# EAGLE schematic iron-hotplate (EAGLE 9.6.2)
CREVISION: 1.0; DESIGNER: Joao Silva

## Sheet 1 of 3: MCU
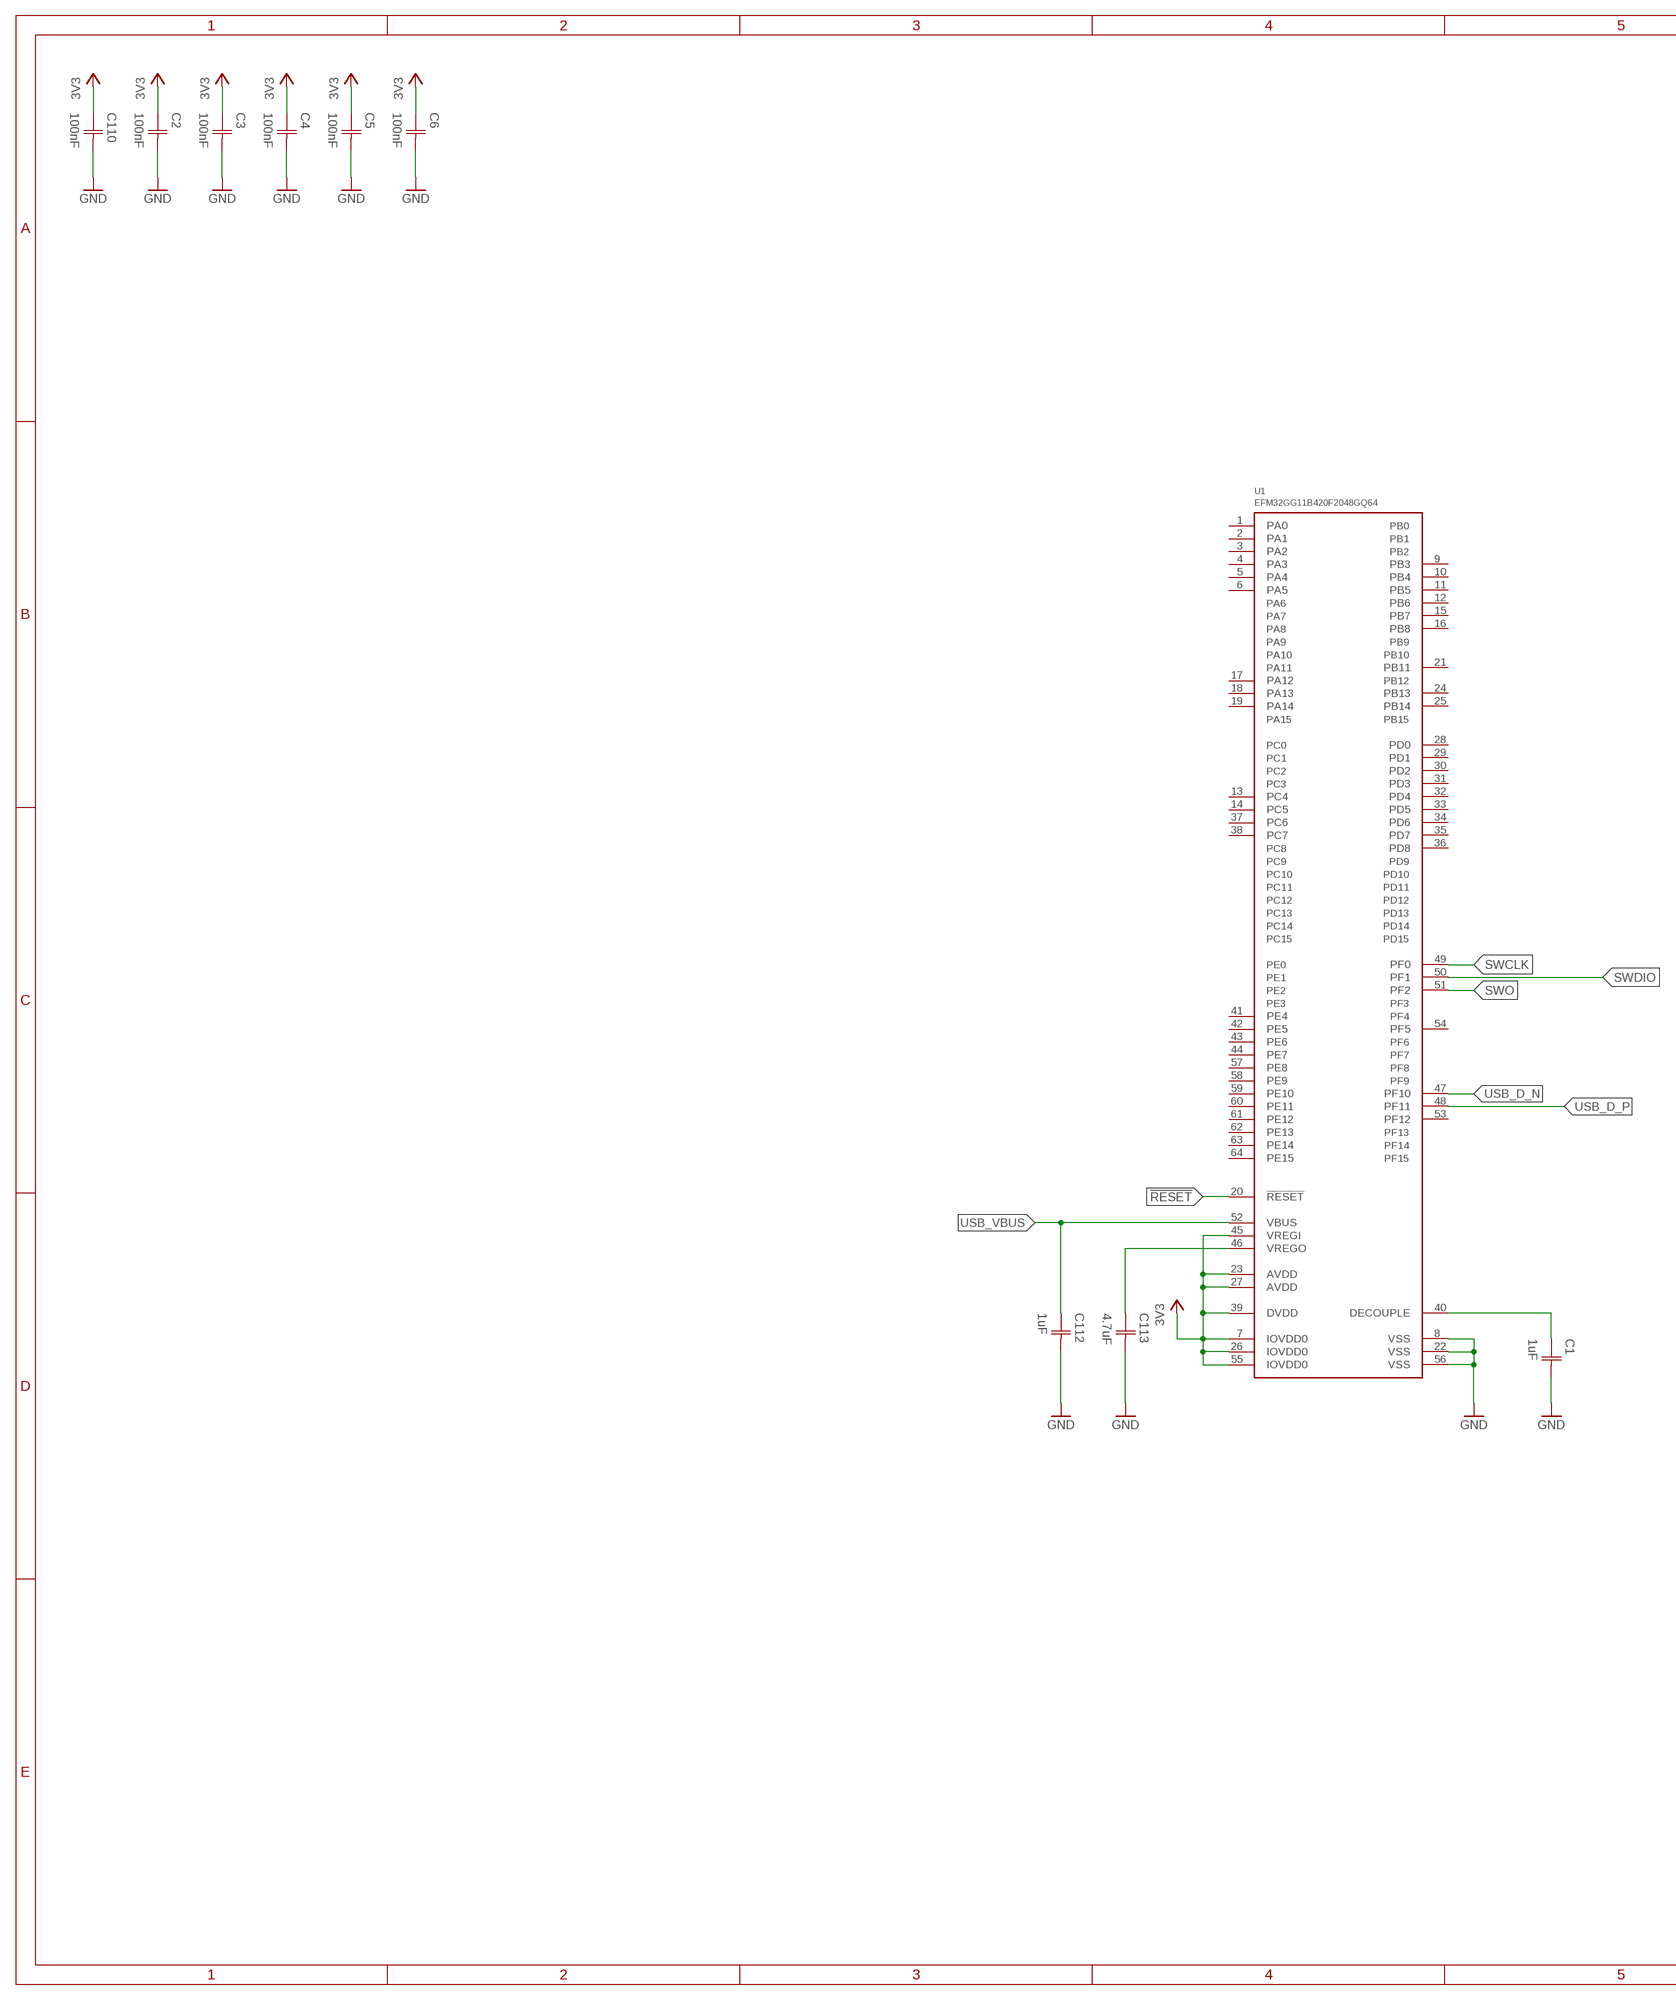
[diagram p0: schematic, sheet 1, part 1 of 2]
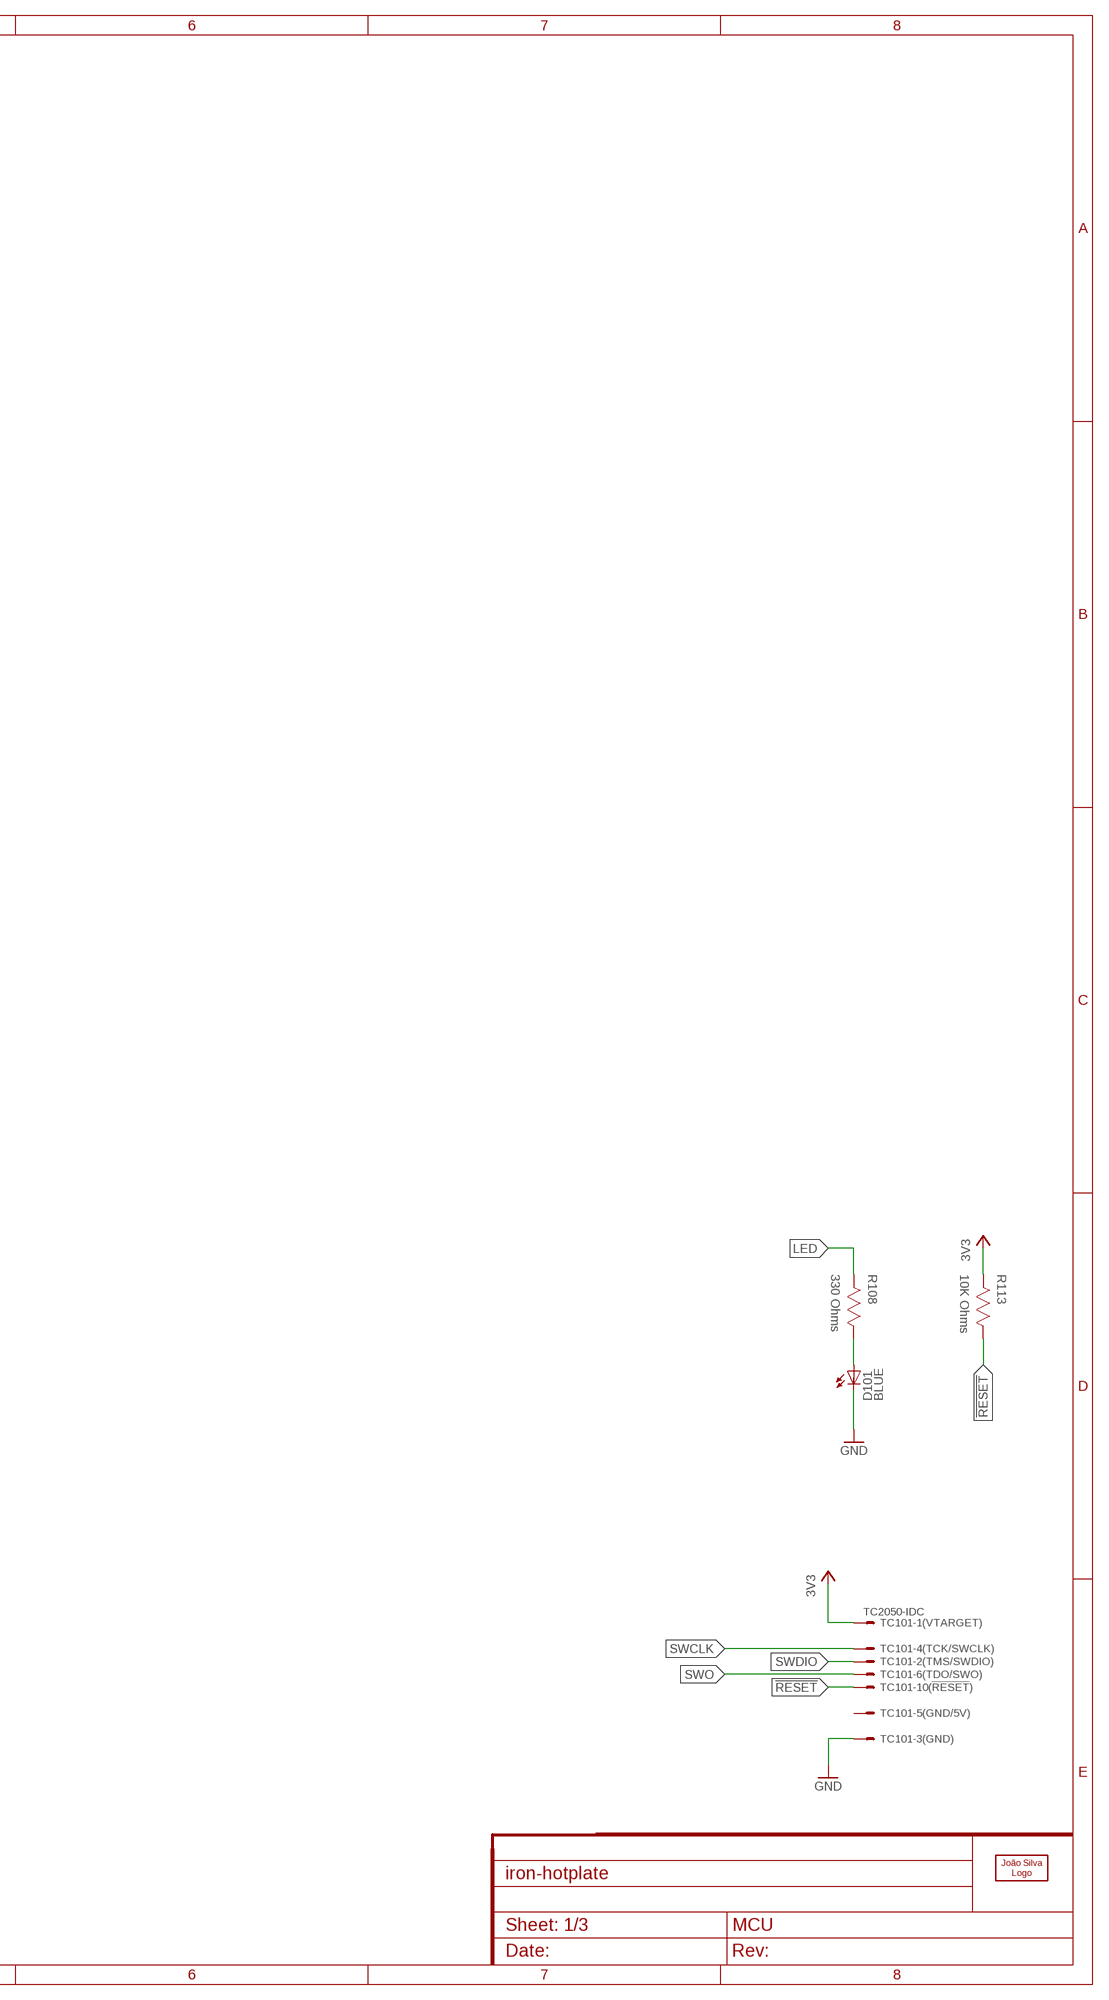
[diagram p1: schematic, sheet 1, part 2 of 2]

### Parts
C1  1uF  CAPACITOR-0402  [CAP0402]
C2  100nF  CAPACITOR-0402  [CAP0402]
C3  100nF  CAPACITOR-0402  [CAP0402]
C4  100nF  CAPACITOR-0402  [CAP0402]
C5  100nF  CAPACITOR-0402  [CAP0402]
C6  100nF  CAPACITOR-0402  [CAP0402]
C110  100nF  CAPACITOR-0402  [CAP0402]
C112  1uF  CAPACITOR-0402  [CAP0402]
C113  4.7uF  CAPACITOR-0603  [CAP0603]
D101  LED0603  [0603]
LOGO1  JS-5MM  [JS_5MM]
R108  330 Ohms  RESISTOR-0402  [RES0402]
R113  10K Ohms  RESISTOR-0402  [RES0402]
TC101  TC2050-IDC  [TC2050-IDC]
U1  EFM32GG11B420F2048GQ64  [QFP64]

### Nets
3V3: C2.1(C1) C3.1(C1) C4.1(C1) C5.1(C1) C6.1(C1) C110.1(C1) R113.2 TC101.1 U1.7(IOVDD0) U1.23(AVDD) U1.26(IOVDD0) U1.27(AVDD) U1.39(DVDD) U1.45(VREGI) U1.55(IOVDD0) ; also sheet 2,3
!RESET: R113.1 TC101.10 U1.20(!RESET)
GND: C1.2(C2) C2.2(C2) C3.2(C2) C4.2(C2) C5.2(C2) C6.2(C2) C110.2(C2) C112.2(C2) C113.2(C2) D101.C TC101.3 U1.8(VSS) U1.22(VSS) U1.56(VSS) ; also sheet 2,3
LED: R108.2
N$1: C1.1(C1) U1.40(DECOUPLE)
N$32: C113.1(C1) U1.46(VREGO)
N$144: D101.A R108.1
SWCLK: TC101.4 U1.49(PF0)
SWDIO: TC101.2 U1.50(PF1)
SWO: TC101.6 U1.51(PF2)
USB_D_N [90 Ohm Differential]: U1.47(PF10)
USB_D_P [90 Ohm Differential]: U1.48(PF11)
USB_VBUS: C112.1(C1) U1.52(VBUS)
Unconnected: TC101.5 TC101.7 TC101.8 TC101.9 U1.1(PA0) U1.2(PA1) U1.3(PA2) U1.4(PA3) U1.5(PA4) U1.6(PA5) U1.9(PB3) U1.10(PB4) U1.11(PB5) U1.12(PB6) U1.13(PC4) U1.14(PC5) U1.15(PB7) U1.16(PB8) U1.17(PA12) U1.18(PA13) U1.19(PA14) U1.21(PB11) U1.24(PB13) U1.25(PB14) U1.28(PD0) U1.29(PD1) U1.30(PD2) U1.31(PD3) U1.32(PD4) U1.33(PD5) U1.34(PD6) U1.35(PD7) U1.36(PD8) U1.37(PC6) U1.38(PC7) U1.41(PE4) U1.42(PE5) U1.43(PE6) U1.44(PE7) U1.53(PF12) U1.54(PF5) U1.57(PE8) U1.58(PE9) U1.59(PE10) U1.60(PE11) U1.61(PE12) U1.62(PE13) U1.63(PE14) U1.64(PE15)

## Sheet 2 of 3: TC Interface
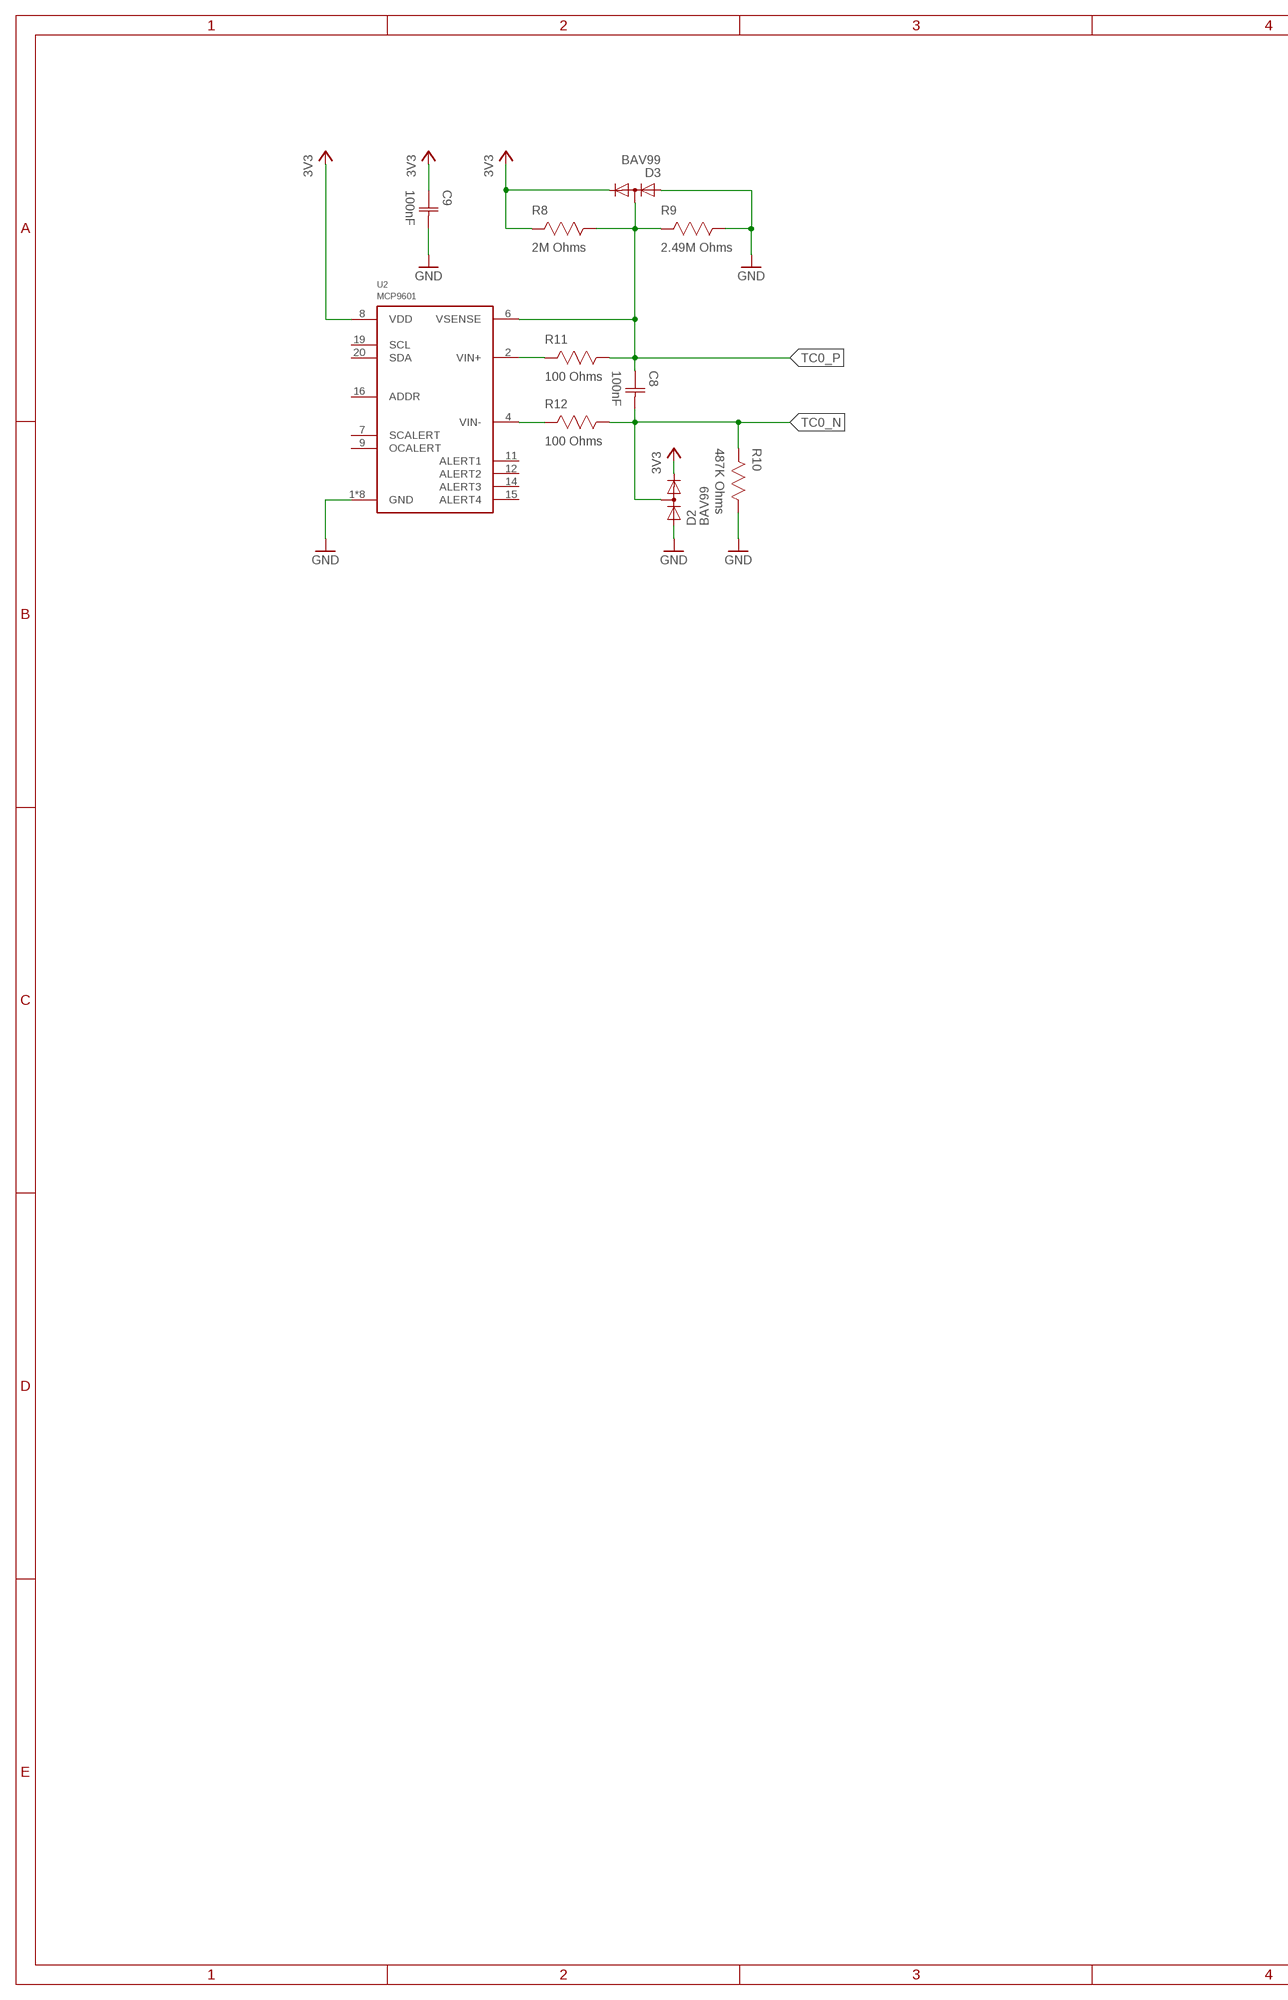
[diagram p2: schematic, sheet 2, part 1 of 2]
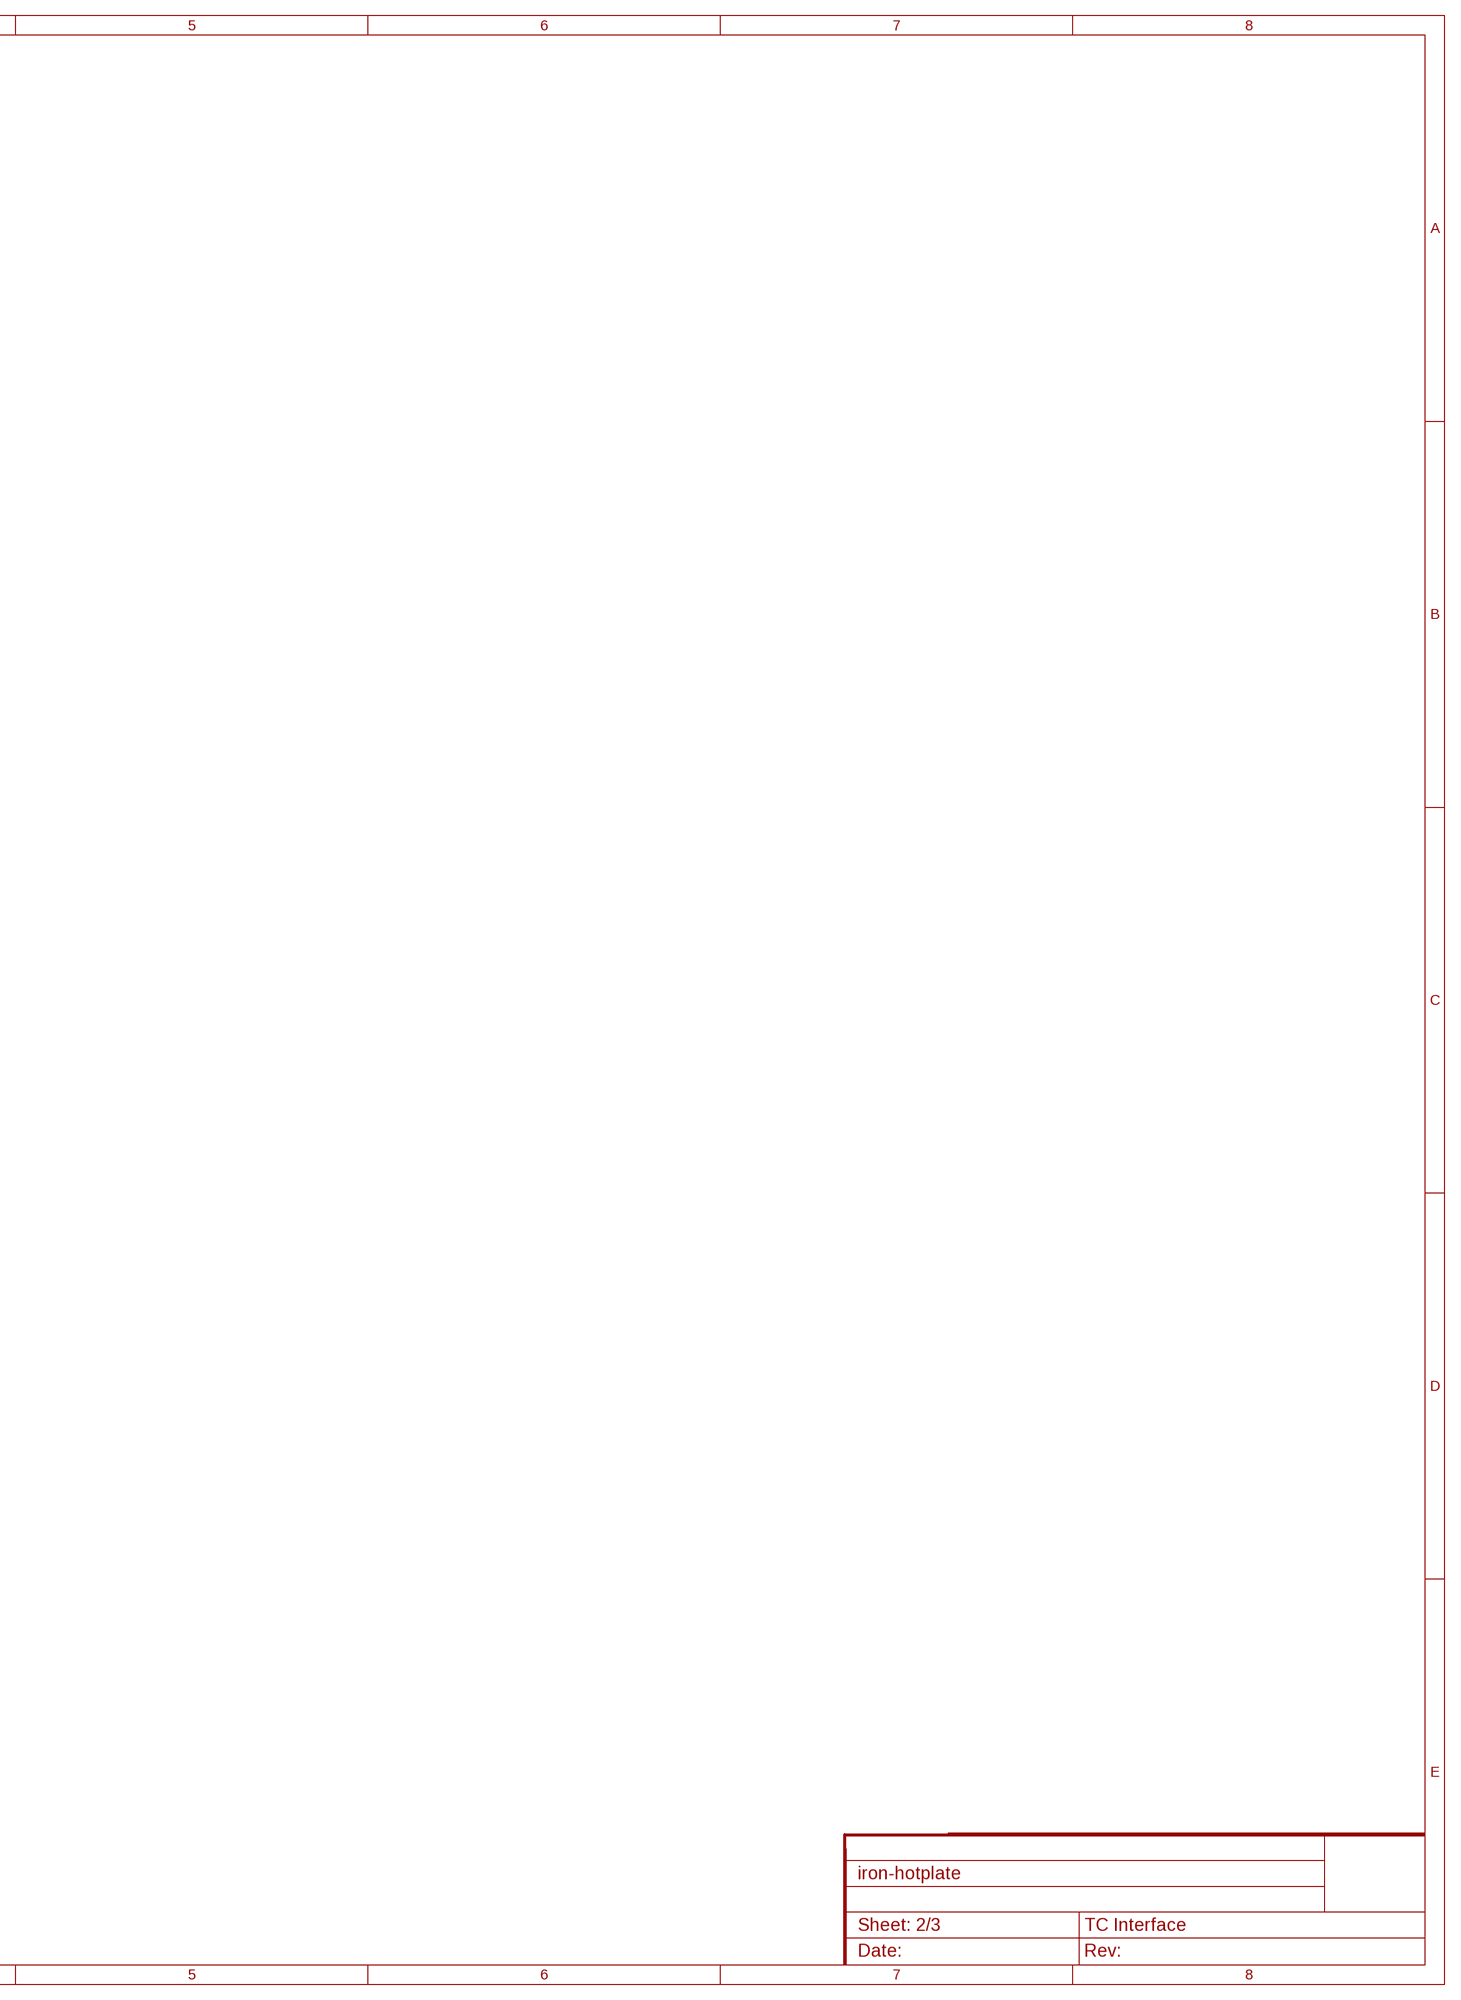
[diagram p3: schematic, sheet 2, part 2 of 2]

### Parts
C8  100nF  CAPACITOR-0402  [CAP0402]
C9  100nF  CAPACITOR-0402  [CAP0402]
D2  BAV99  [SOT23]
D3  BAV99  [SOT23]
R8  2M Ohms  RESISTOR-0402  [RES0402]
R9  2.49M Ohms  RESISTOR-0402  [RES0402]
R10  487K Ohms  RESISTOR-0402  [RES0402]
R11  100 Ohms  RESISTOR-0402  [RES0402]
R12  100 Ohms  RESISTOR-0402  [RES0402]
U2  MCP9601  [MQFN20]

### Nets
3V3: C9.1(C1) D2.2(C) D3.2(C) R8.2 U2.8(VDD) ; also sheet 1,3
GND: C9.2(C2) D2.1(A) D3.1(A) R9.1 R10.1 U2.1(GND) U2.3(GND) U2.5(GND) U2.10(GND) U2.13(GND) U2.17(GND) U2.18(GND) U2.EXP(GND) ; also sheet 1,3
N$8: R11.2 U2.2(VIN+)
N$9: R12.2 U2.4(VIN-)
TC0_N: C8.2(C2) D2.3(MID) R10.2 R12.1
TC0_P: C8.1(C1) D3.3(MID) R8.1 R9.2 R11.1 U2.6(VSENSE)
Unconnected: U2.7(SCALERT) U2.9(OCALERT) U2.11(ALERT1) U2.12(ALERT2) U2.14(ALERT3) U2.15(ALERT4) U2.16(ADDR) U2.19(SCL) U2.20(SDA)

## Sheet 3 of 3: Power
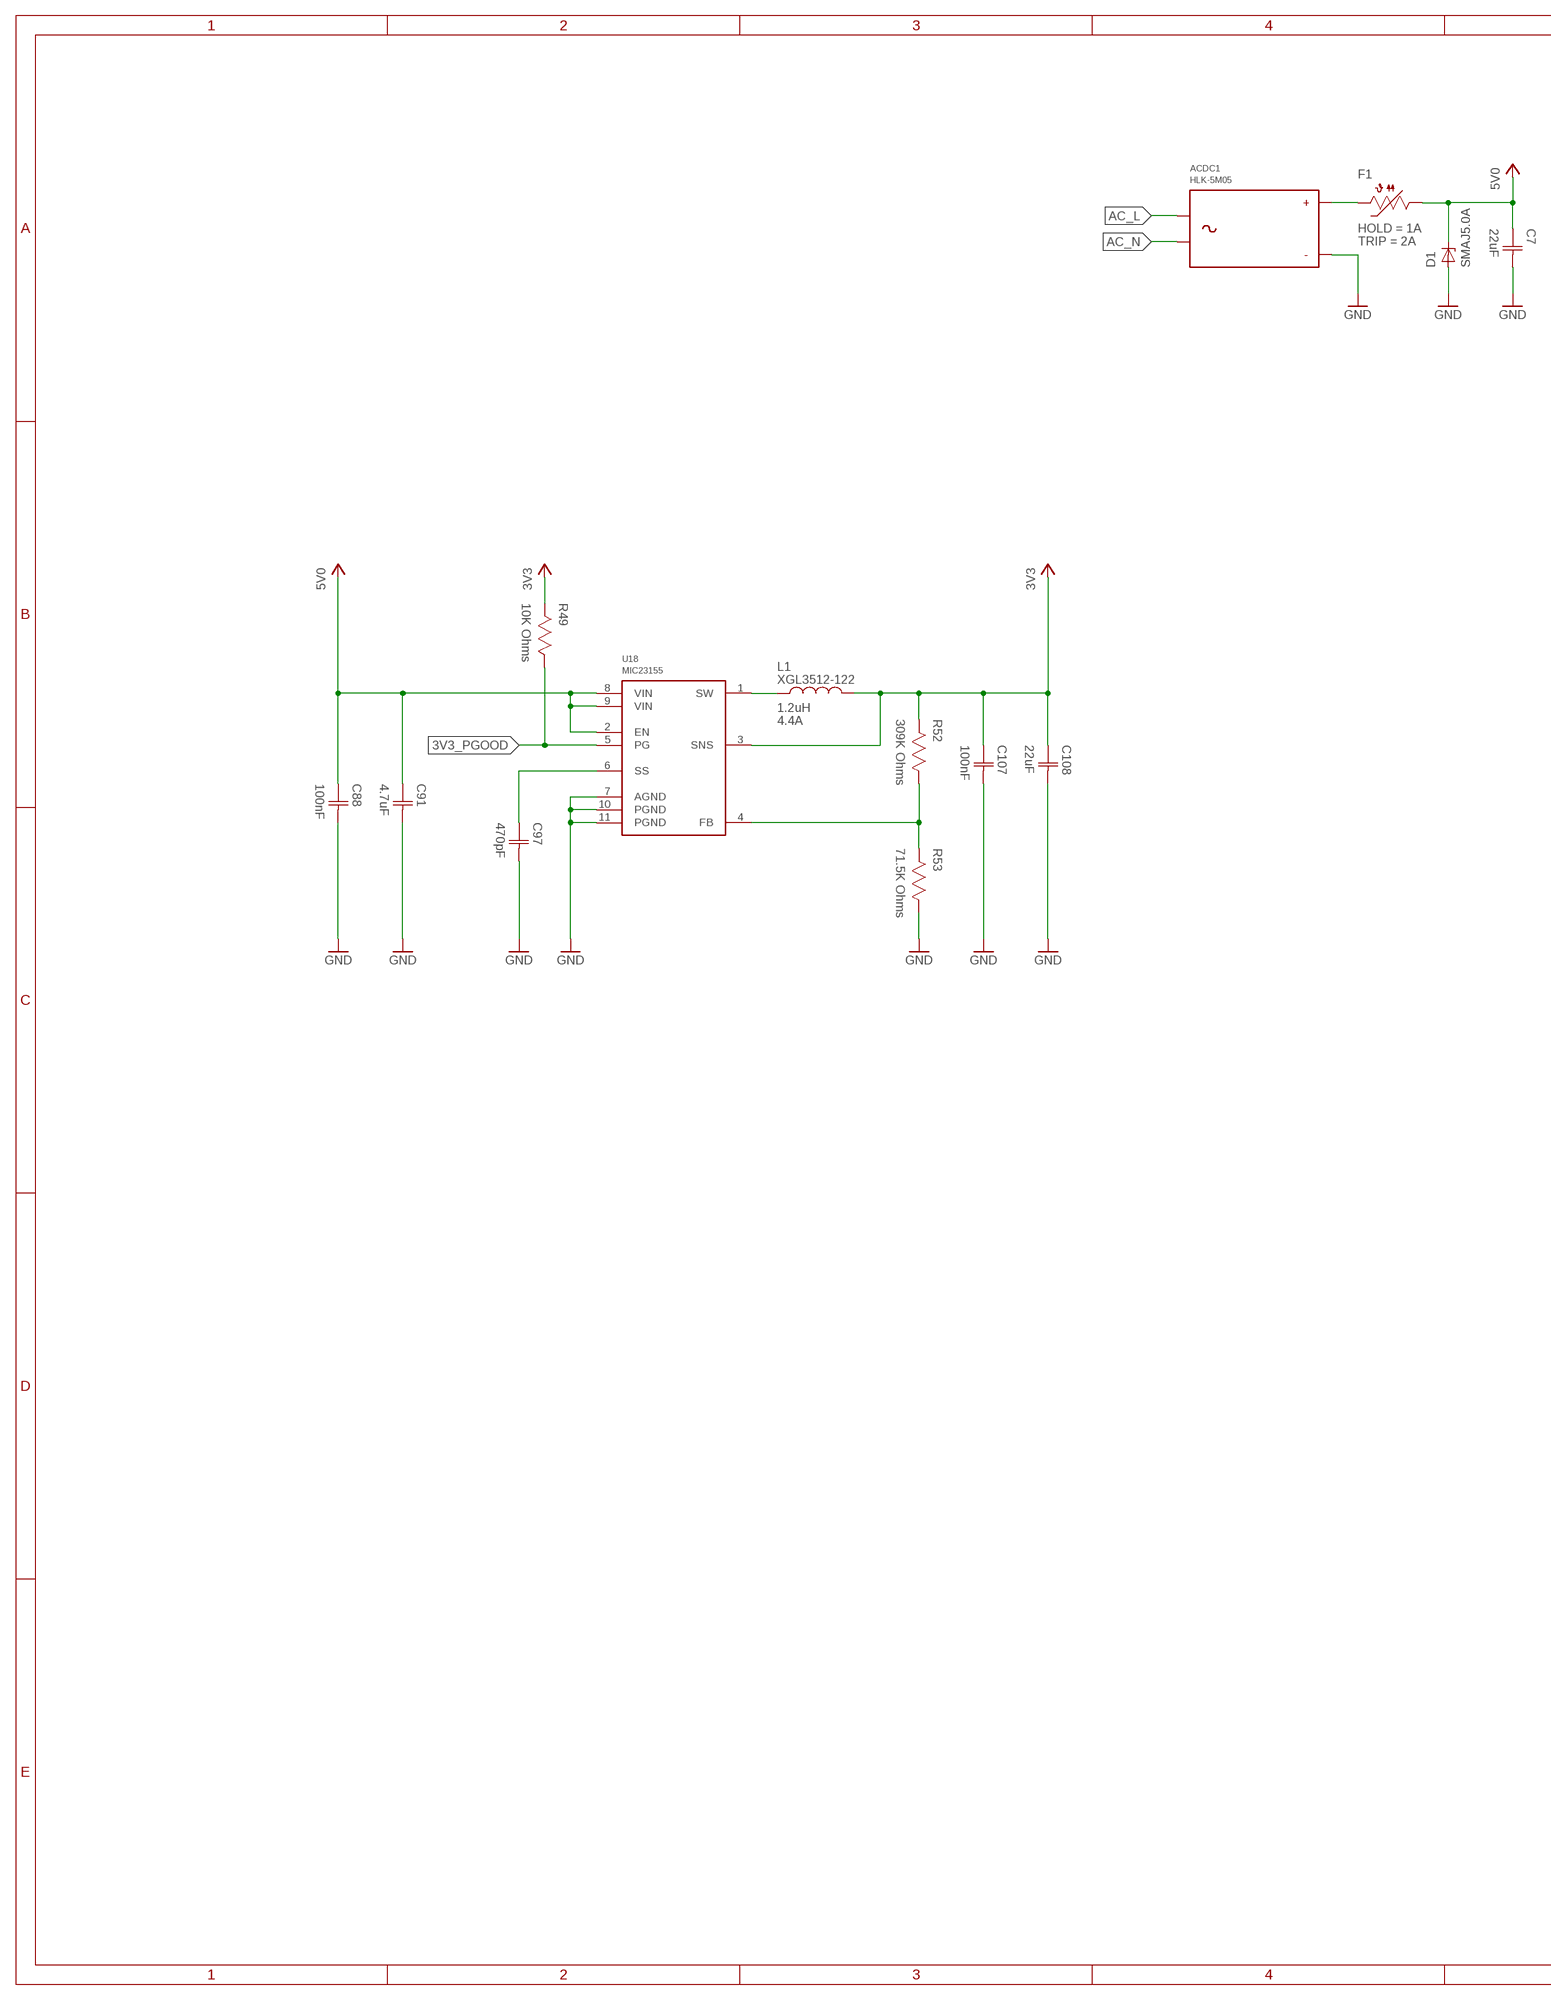
[diagram p4: schematic, sheet 3, part 1 of 2]
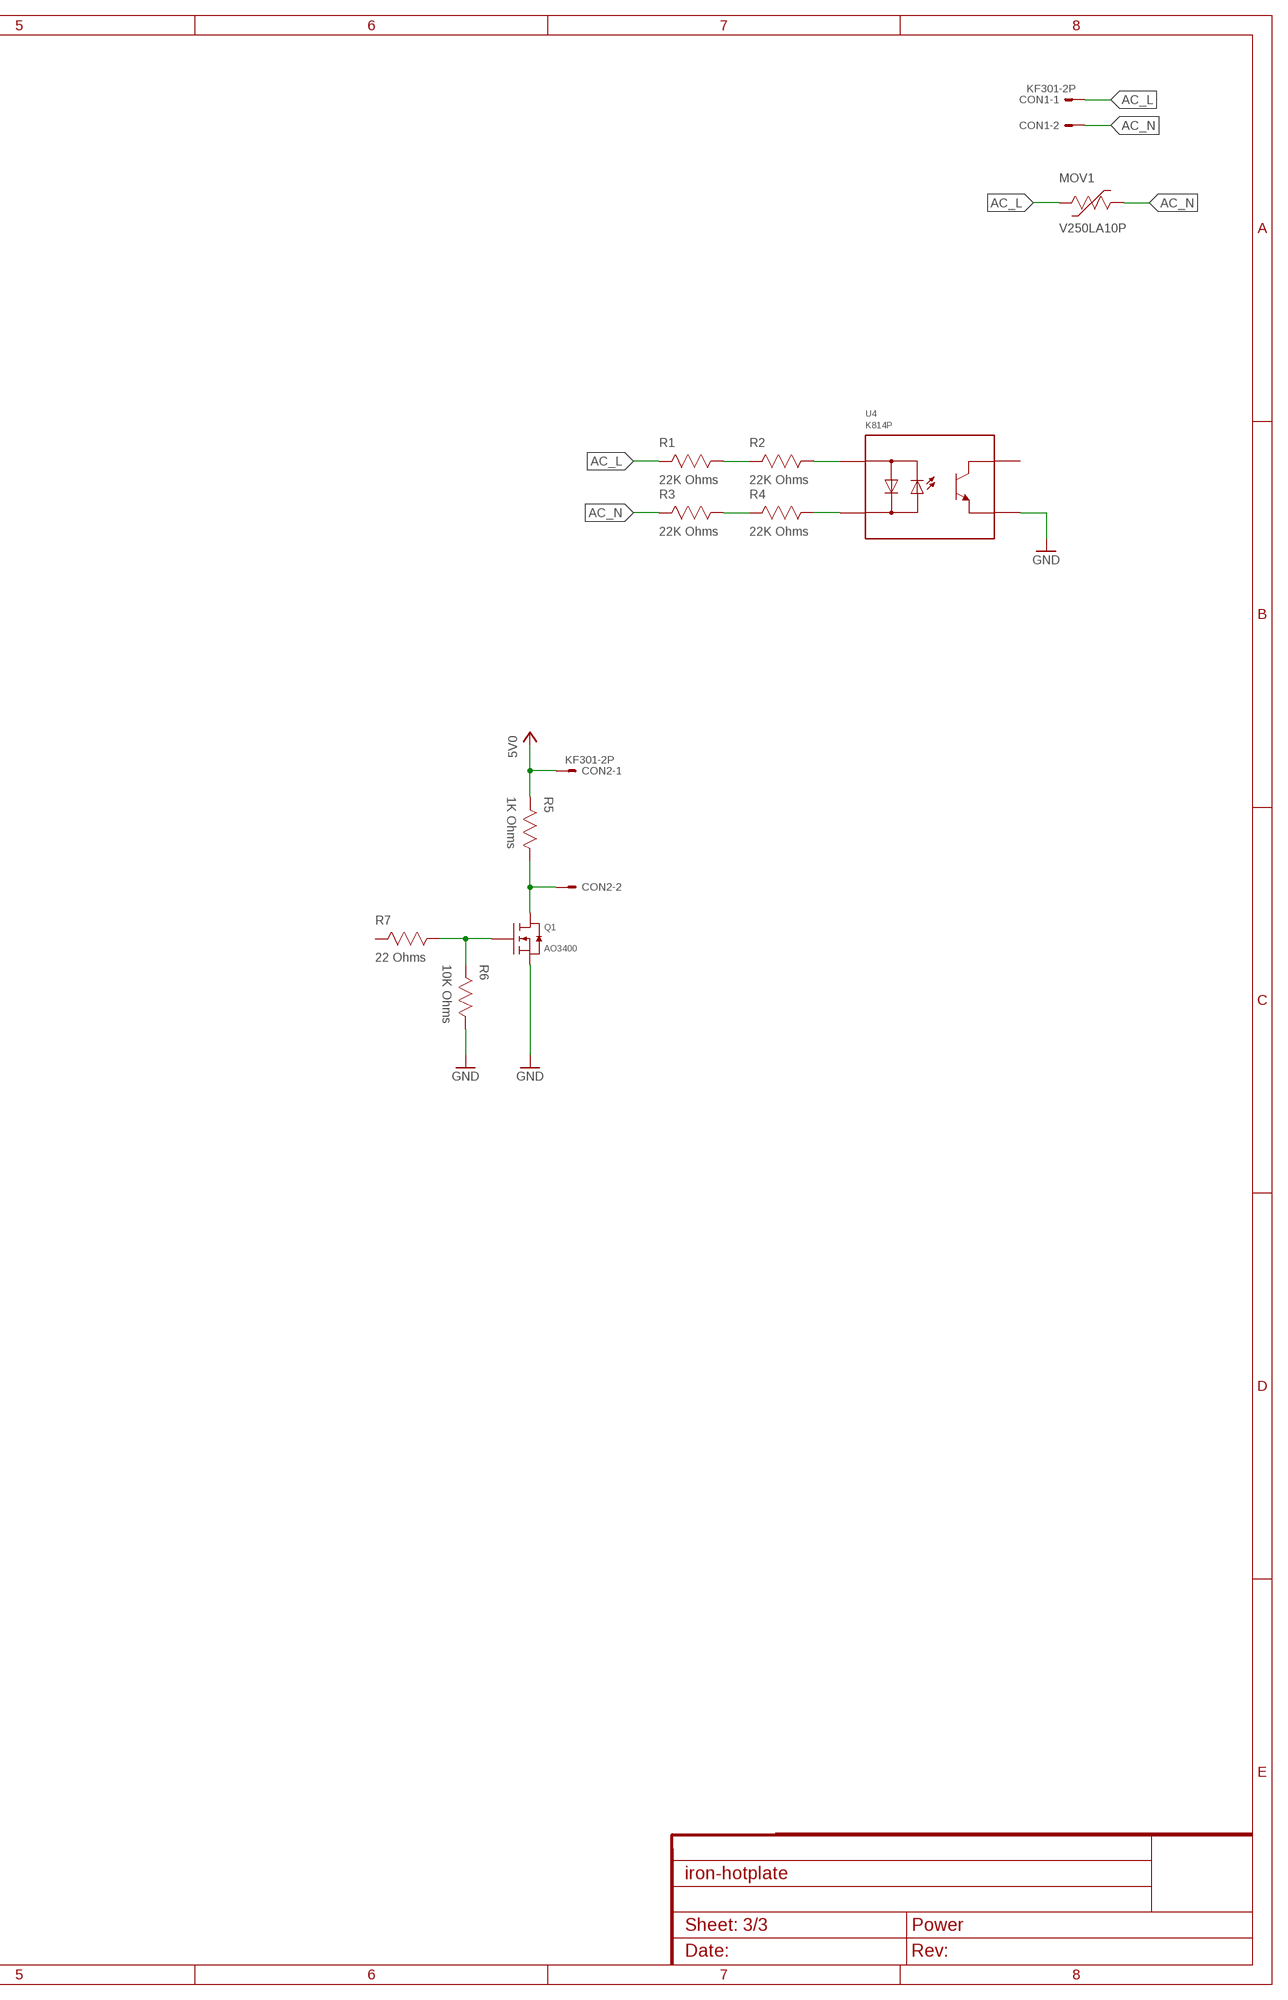
[diagram p5: schematic, sheet 3, part 2 of 2]

### Parts
ACDC1  HLK-5M05  [HLK-5M05]
C7  22uF  CAPACITOR-1206  [CAP1206]
C88  100nF  CAPACITOR-0402  [CAP0402]
C91  4.7uF  CAPACITOR-0603  [CAP0603]
C97  470pF  CAPACITOR-0402  [CAP0402]
C107  100nF  CAPACITOR-0402  [CAP0402]
C108  22uF  CAPACITOR-1206  [CAP1206]
CON1  KF301-2P  [KF301-2P]
CON2  KF301-2P  [KF301-2P]
D1  SMAJ5.0A  [DO214AC]
F1  PTC1206  [1206]
L1  1.2uH  XGL3512-122  [XGL351X]
MOV1  V250LA10P  [VXXXLA10P]
Q1  AO3400  [SOT23]
R1  22K Ohms  RESISTOR-1206  [RES1206]
R2  22K Ohms  RESISTOR-1206  [RES1206]
R3  22K Ohms  RESISTOR-1206  [RES1206]
R4  22K Ohms  RESISTOR-1206  [RES1206]
R5  1K Ohms  RESISTOR-0402  [RES0402]
R6  10K Ohms  RESISTOR-0402  [RES0402]
R7  22 Ohms  RESISTOR-0402  [RES0402]
R49  10K Ohms  RESISTOR-0402  [RES0402]
R52  309K Ohms  RESISTOR-0402  [RES0402]
R53  71.5K Ohms  RESISTOR-0402  [RES0402]
U4  K814P  [DIP_2.54]
U18  MIC23155  [DFN10]

### Nets
3V3: C107.1(C1) C108.1(C1) L1.2 R49.2 R52.2 U18.3(SNS) ; also sheet 1,2
3V3_FB: R52.1 R53.2 U18.4(FB)
3V3_PGOOD: R49.1 U18.5(PG)
3V3_SS: C97.1(C1) U18.6(SS)
3V3_SW: L1.1 U18.1(SW)
5V0: C7.1(C1) C88.1(C1) C91.1(C1) CON2.1 D1.C F1.1 R5.2 U18.2(EN) U18.8(VIN) U18.9(VIN)
5V0_UNFUSED: ACDC1.+VO F1.2
AC_L: ACDC1.AC1 CON1.1 MOV1.2 R1.2
AC_N: ACDC1.AC2 CON1.2 MOV1.1 R3.2
GND: ACDC1.-VO C7.2(C2) C88.2(C2) C91.2(C2) C97.2(C2) C107.2(C2) C108.2(C2) D1.A Q1.2(S) R6.1 R53.1 U4.3(E) U18.7(AGND) U18.10(PGND) U18.11(PGND) ; also sheet 1,2
N$2: R3.1 R4.2
N$3: R1.1 R2.2
N$4: R2.1 U4.1(LED1)
N$5: R4.1 U4.2(LED2)
N$6: CON2.2 Q1.3(D) R5.1
N$7: Q1.1(G) R6.2 R7.1
Unconnected: R7.2 U4.4(C)

## Library data of the parts
ACDC1 = ACDC Converter:HLK-5M
C1-C9 C88 C91 C97 C107 C108 C110 C112 C113 = Capacitor:CAPACITOR
CON1 CON2 = Generic Connector:KF301-2P
D1 = TVS:SMAJ*A: SMAJ Series TVS Diodes Source: http://www.littelfuse.com/~/media/electronics/datasheets/tvs_diodes/littelfuse_tvs_diode_smaj_datasheet.pdf.pdf; MF: Littelfuse; MPN: SMAJ5.0A; OC_FARNELL: 1827607; OC_NEWARK: 71J2029
D2 D3 = Generic Diode:BAV99
D101 = LED:LED; COLOR: BLUE
F1 = Fuses:PTC; HOLD: 1A; TRIP: 2A
L1 = Coilcraft:XGL3512-; CURRENT: 4.4A; REF: XGL3512-122
LOGO1 = Silkscreen:JS
MOV1 = Varistor:V250LA10P
Q1 = Alpha Omega:AO3400
R1-R12 R49 R52 R53 R108 R113 = Resistor:RESISTOR
TC101 = TagConnect:TC2050-IDC
U1 = EFM32:EFM32GG11B4*Q64
U2 = Microchip:MCP9601
U4 = Generic Optocoupler:K814P
U18 = Microchip:MIC23155

## Net classes
2 90 Ohm Differential: width 0.175 mm, clearance 0.102 mm